# Altium schematic sheet LED.SchDoc
size A4; DocumentNumber: 3; SheetNumber: 3; SheetTotal: 21; SheetName: Debug LEDs
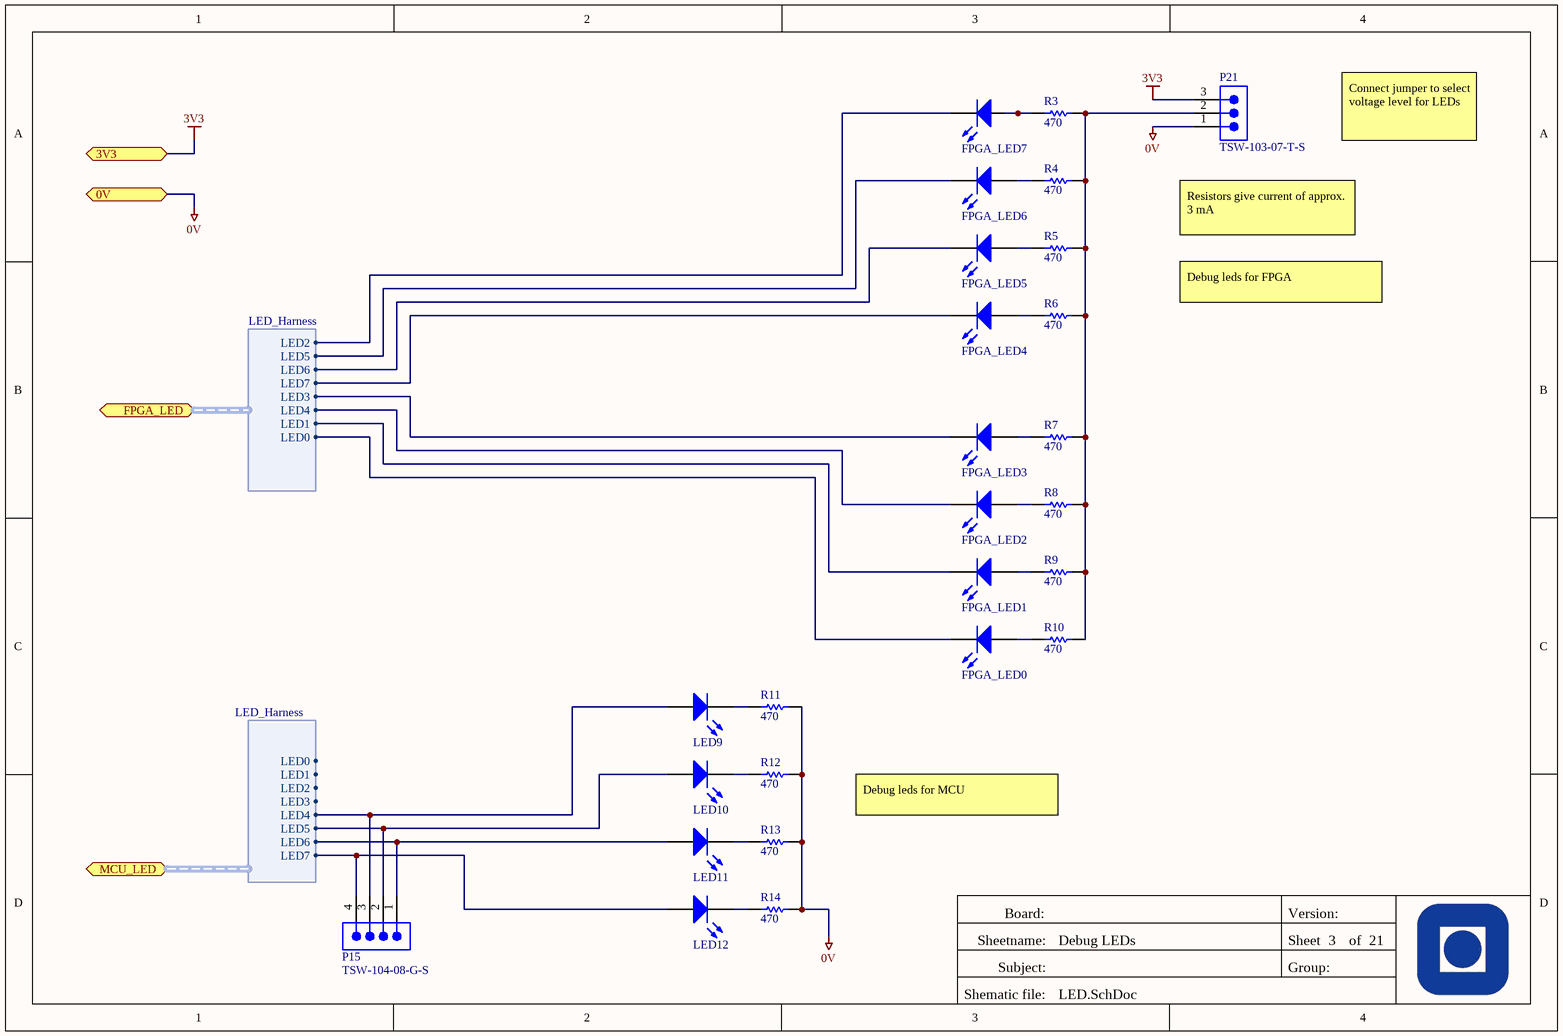
[diagram p0: LED.SchDoc]

## Parts
FPGA_LED0  150060RS75000  [0603_A]  (value not drawn)
FPGA_LED1  150060RS75000  [0603_A]  (value not drawn)
FPGA_LED2  150060RS75000  [0603_A]  (value not drawn)
FPGA_LED3  150060RS75000  [0603_A]  (value not drawn)
FPGA_LED4  150060RS75000  [0603_A]  (value not drawn)
FPGA_LED5  150060RS75000  [0603_A]  (value not drawn)
FPGA_LED6  150060RS75000  [0603_A]  (value not drawn)
FPGA_LED7  150060RS75000  [0603_A]  (value not drawn)
LED9  150060RS75000  [0603_A]  (value not drawn)
LED10  150060RS75000  [0603_A]  (value not drawn)
LED11  150060RS75000  [0603_A]  (value not drawn)
LED12  150060RS75000  [0603_A]  (value not drawn)
P15  TSW-104-08-G-S  [SMTC-TSW-104-08-X-S]
P21  TSW-103-07-T-S  [SMTC-TSW-103-07-X-S]
R3  value 470  [RESC0603(1608)_N]  (hidden comment: 470R 5% 0603(1608))
R4  value 470  [RESC0603(1608)_N]  (hidden comment: 470R 5% 0603(1608))
R5  value 470  [RESC0603(1608)_N]  (hidden comment: 470R 5% 0603(1608))
R6  value 470  [RESC0603(1608)_N]  (hidden comment: 470R 5% 0603(1608))
R7  value 470  [RESC0603(1608)_N]  (hidden comment: 470R 5% 0603(1608))
R8  value 470  [RESC0603(1608)_N]  (hidden comment: 470R 5% 0603(1608))
R9  value 470  [RESC0603(1608)_N]  (hidden comment: 470R 5% 0603(1608))
R10  value 470  [RESC0603(1608)_N]  (hidden comment: 470R 5% 0603(1608))
R11  value 470  [RESC0603(1608)_N]  (hidden comment: 470R 5% 0603(1608))
R12  value 470  [RESC0603(1608)_N]  (hidden comment: 470R 5% 0603(1608))
R13  value 470  [RESC0603(1608)_N]  (hidden comment: 470R 5% 0603(1608))
R14  value 470  [RESC0603(1608)_N]  (hidden comment: 470R 5% 0603(1608))

## Ports
0V, 3V3, FPGA_LED (harness LED_Harness), MCU_LED (harness LED_Harness)

## Harnesses
LED_Harness: LED0, LED1, LED2, LED3, LED4, LED5, LED6, LED7
LED_Harness: LED1, LED2, LED3, LED4, LED5, LED6, LED7, LED0

## Nets
0V: P21.1 R11.2 R12.2 R13.2 R14.2 ; port 0V
3V3: P21.3 ; port 3V3
NetFPGA_LED0_1: FPGA_LED0.1(K) ; port FPGA_LED.LED0
NetFPGA_LED0_2: FPGA_LED0.2(A) R10.1
NetFPGA_LED1_1: FPGA_LED1.1(K) ; port FPGA_LED.LED1
NetFPGA_LED1_2: FPGA_LED1.2(A) R9.1
NetFPGA_LED2_1: FPGA_LED2.1(K) ; port FPGA_LED.LED4
NetFPGA_LED2_2: FPGA_LED2.2(A) R8.1
NetFPGA_LED3_1: FPGA_LED3.1(K) ; port FPGA_LED.LED3
NetFPGA_LED3_2: FPGA_LED3.2(A) R7.1
NetFPGA_LED4_1: FPGA_LED4.1(K) ; port FPGA_LED.LED7
NetFPGA_LED4_2: FPGA_LED4.2(A) R6.1
NetFPGA_LED5_1: FPGA_LED5.1(K) ; port FPGA_LED.LED6
NetFPGA_LED5_2: FPGA_LED5.2(A) R5.1
NetFPGA_LED6_1: FPGA_LED6.1(K) ; port FPGA_LED.LED5
NetFPGA_LED6_2: FPGA_LED6.2(A) R4.1
NetFPGA_LED7_1: FPGA_LED7.1(K) ; port FPGA_LED.LED2
NetFPGA_LED7_2: FPGA_LED7.2(A) R3.1
NetLED9_1: LED9.1(K) R11.1
NetLED9_2: LED9.2(A) P15.3 ; port MCU_LED.LED4
NetLED10_1: LED10.1(K) R12.1
NetLED10_2: LED10.2(A) P15.2 ; port MCU_LED.LED5
NetLED11_1: LED11.1(K) R13.1
NetLED11_2: LED11.2(A) P15.1 ; port MCU_LED.LED6
NetLED12_1: LED12.1(K) R14.1
NetLED12_2: LED12.2(A) P15.4 ; port MCU_LED.LED7
NetP21_2: P21.2 R3.2 R4.2 R5.2 R6.2 R7.2 R8.2 R9.2 R10.2

## Notes on the sheet
- Connect jumper to select voltage level for LEDs
- Resistors give current of approx. 3 mA
- Debug leds for FPGA
- Debug leds for MCU
- Board:
- Version:
- Sheetname:
- Subject:
- Group:
- Sheet
- of
- Shematic file:

## Library data of the parts
FPGA_LED0-FPGA_LED7 LED9-LED12 = CMP-1426-00001-1: SMD mono-color Chip LED, WL-SMCW, Red; Manufacturer: Wuerth Elektronik; Color: Red; PackageReference: 0603_A; ComponentLink2URL: http://katalog.we-online.com/led/datasheet/150060RS75000.pdf; ComponentLink1URL: http://www.we-online.com; ComponentLink1Description: Manufacturer URL; ComponentLink2Description: Datasheet; PartNumber: 150060RS75000
P15 = CMP-1024-00357-1: 0.025" SQ Post Header, Through-hole, Vertical, -55 to 125 degC, 2.54 mm Pitch, 4-Pin, Male, RoHS; Manufacturer: Samtec; Pitch: 2.54 mm; RoHS: True; ComponentLink3URL: http://www.samtec.com/documents/webfiles/cpdf/TSW-XXX-XX-XXX-X-XX-XXX-MKT.pdf; Mounting Technology: Through-hole; ComponentLink2URL: http://www.samtec.com/documents/webfiles/pdf/TSW_TH.PDF; ComponentLink1URL: http://www.samtec.com; ComponentLink3Description: Package Specification; PackageVersion: DM, 8/1988; ComponentLink2Description: Datasheet; PackageReference: TSW-104-08-X-S; PackageDescription: .025[0.64] SQ. Post Terminal Strip Assembly; PartNumber: TSW-104-08-G-S; ComponentLink1Description: Manufacturer URL; Temperature Range: -55 to 125 degC; DatasheetVersion: F-214; Orientation: Vertical
P21 = CMP-1024-00332-1: Manufacturer: Samtec; Pitch: 2.54 mm; ComponentLink1URL: http://www.samtec.com; ComponentLink3URL: http://www.samtec.com/documents/webfiles/cpdf/TSW-XXX-XX-XXX-X-XX-XXX-MKT.pdf; PartNumber: TSW-103-07-T-S; Mounting Technology: Through-hole; RoHS: True; DatasheetVersion: F-214; PackageVersion: DM, 8/1988; Temperature Range: -55 to 105 degC; ComponentLink2Description: Datasheet; ComponentLink1Description: Manufacturer URL; Orientation: Vertical; PackageReference: TSW-103-07-X-S; ComponentLink3Description: Package Specification; ComponentLink2URL: http://www.samtec.com/documents/webfiles/pdf/TSW_TH.PDF; PackageDescription: .025[0.64] SQ. Post Terminal Strip Assembly
R3-R14 = CMP-1012-00066-1: 470R 0.1W 5% 0603 (1608 Metric)  SMD; Case-Metric: 1608; Case-EIA: 0603; Tolerance: 5 %; Technology: SMT; Power: 0.1 W